# Altium schematic sheet ADC.SchDoc
size A4
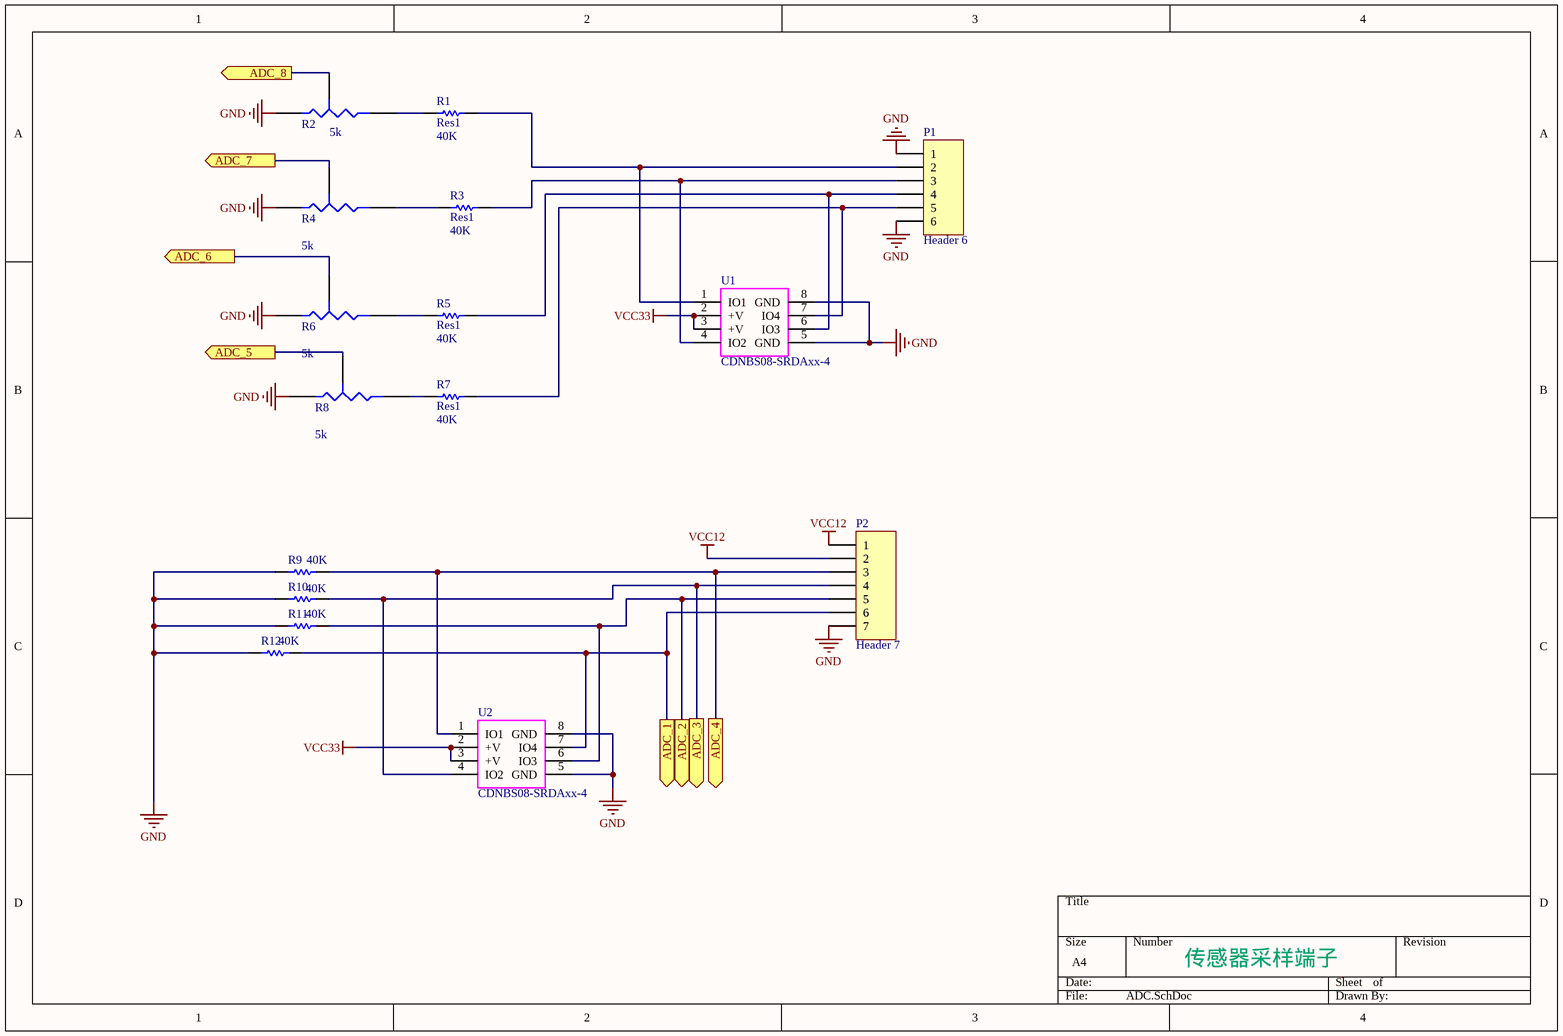
[diagram p0: ADC.SchDoc]

## Parts
P1  Header 6  [3.81-6P]
P2  Header 7  [3.81-7P]
R1  Res1  value 40K  [AXIAL-0.1]
R2  value 5k  [RES-RV3296W]  (hidden comment: Res Tap)
R3  Res1  value 40K  [AXIAL-0.1]
R4  value 5k  [RES-RV3296W]  (hidden comment: Res Tap)
R5  Res1  value 40K  [AXIAL-0.1]
R6  value 5k  [RES-RV3296W]  (hidden comment: Res Tap)
R7  Res1  value 40K  [AXIAL-0.1]
R8  value 5k  [RES-RV3296W]  (hidden comment: Res Tap)
R9  value 40K  [AXIAL-0.2]  (hidden comment: Res1)
R10  value 40K  [AXIAL-0.2]  (hidden comment: Res1)
R11  value 40K  [AXIAL-0.2]  (hidden comment: Res1)
R12  value 40K  [AXIAL-0.2]  (hidden comment: Res1)
U1  CDNBS08-SRDAxx-4  [CDNBS08-SRDAxx-4]
U2  CDNBS08-SRDAxx-4  [CDNBS08-SRDAxx-4]

## Ports
ADC_1 (out), ADC_2 (out), ADC_3 (out), ADC_4 (out), ADC_5 (out), ADC_6 (out), ADC_7 (out), ADC_8 (out)

## Nets
GND: P1.1 P1.6 P2.7 R2.1(A) R4.1(A) R6.1(A) R8.1(A) R9.1 R10.1 R11.1 R12.1 U1.5(GND) U1.8(GND) U2.5(GND) U2.8(GND)
VCC12: P2.1 P2.2
VCC33: U1.2(+V) U1.3(+V) U2.2(+V) U2.3(+V)
ADC_1: P2.6 R12.2 U2.7(IO4) ; port ADC_1
ADC_2: P2.5 R11.2 U2.6(IO3) ; port ADC_2
ADC_3: P2.4 R10.2 U2.4(IO2) ; port ADC_3
ADC_4: P2.3 R9.2 U2.1(IO1) ; port ADC_4
ADC_5: R8.3(TAP) ; port ADC_5
ADC_6: R6.3(TAP) ; port ADC_6
ADC_7: R4.3(TAP) ; port ADC_7
ADC_8: R2.3(TAP) ; port ADC_8
NetP1_2: P1.2 R1.2 U1.1(IO1)
NetP1_3: P1.3 R3.2 U1.4(IO2)
NetP1_4: P1.4 R5.2 U1.6(IO3)
NetP1_5: P1.5 R7.2 U1.7(IO4)
NetR1_1: R1.1 R2.2(B)
NetR3_1: R3.1 R4.2(B)
NetR5_1: R5.1 R6.2(B)
NetR7_1: R7.1 R8.2(B)

## Notes on the sheet
- 传感器采样端子

## Library data of the parts
P1 = Header 6: Header, 6-Pin; LatestRevisionDate: 17-Jul-2002; LatestRevisionNote: Re-released for DXP Platform.; Publisher: Altium Limited
P2 = Header 7: Header, 7-Pin; LatestRevisionDate: 17-Jul-2002; LatestRevisionNote: Re-released for DXP Platform.; Publisher: Altium Limited
R1 R3 R5 R7 R9-R12 = Res1: Resistor; Published: 8-Jun-2000; LatestRevisionDate: 17-Jul-2002; LatestRevisionNote: Re-released for DXP Platform.; PackageReference: AXIAL-0.3; Publisher: Altium Limited
R2 R4 R6 R8 = Res Tap: Tapped Resistor; Sim Note: Enter the Resistance value and the set point into parameter fields.; Set Position: 0.5; Published: 24-Mar-1999; LatestRevisionDate: 17-Jul-2002; LatestRevisionNote: Re-released for DXP Platform.; PackageReference: VR3; Publisher: Altium Limited